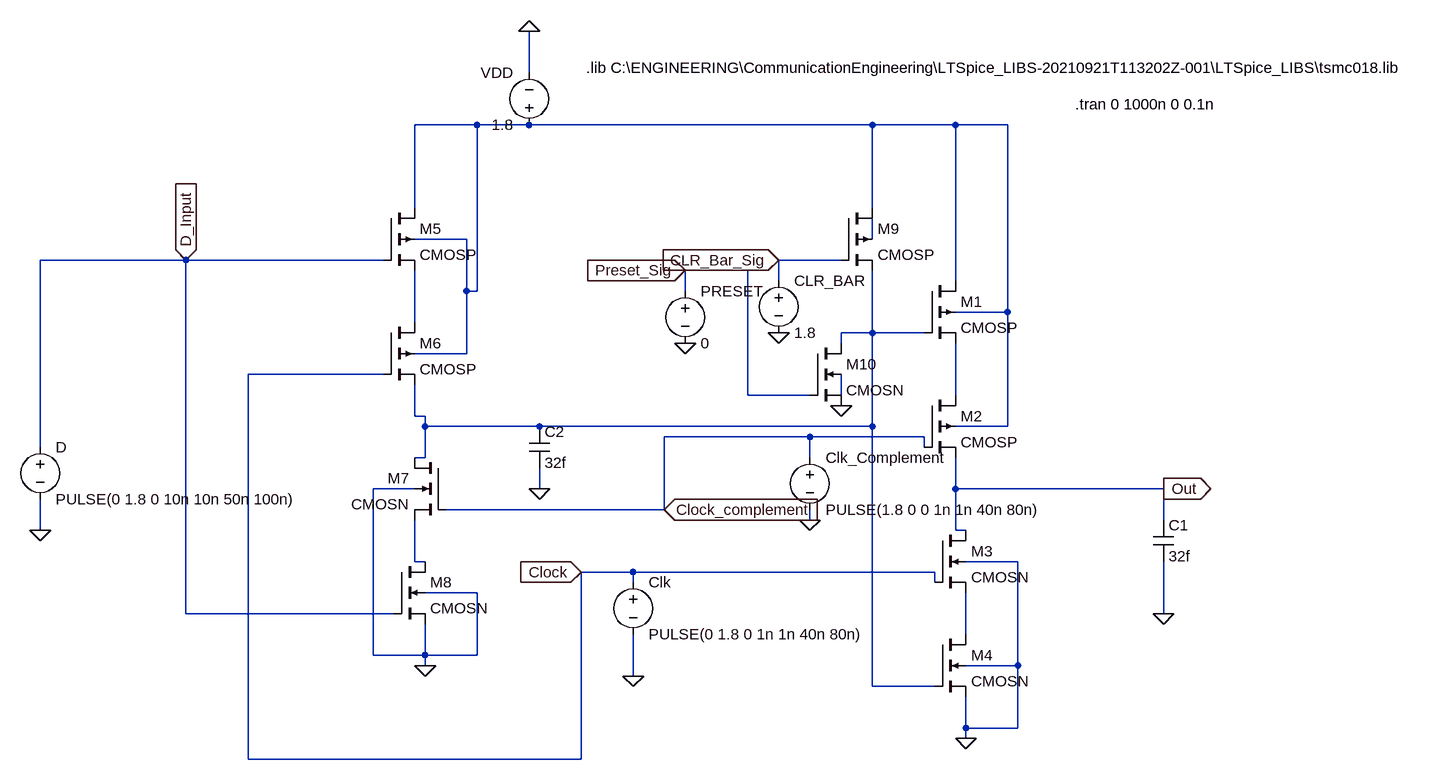
[diagram p0: schematic D_Flip_Flop_design.asc]
D_Flip_Flop_design.asc, the LTspice schematic file:
Version 4
SHEET 1 1324 1044
WIRE -160 -16 -160 -80
WIRE -240 64 -336 64
WIRE -160 64 -240 64
WIRE 368 64 -160 64
WIRE 496 64 368 64
WIRE 576 64 496 64
WIRE -336 192 -336 64
WIRE 368 192 368 64
WIRE -256 240 -336 240
WIRE 368 240 368 208
WIRE -688 272 -912 272
WIRE -384 272 -688 272
WIRE 320 272 224 272
WIRE 176 288 80 288
WIRE 224 304 224 272
WIRE 496 304 496 64
WIRE -256 320 -256 240
WIRE -240 320 -240 64
WIRE -240 320 -256 320
WIRE 80 320 80 288
WIRE 576 352 576 64
WIRE 576 352 496 352
WIRE -336 368 -336 288
WIRE 368 384 368 288
WIRE 368 384 320 384
WIRE 448 384 368 384
WIRE 320 400 320 384
WIRE -256 416 -256 320
WIRE -256 416 -336 416
WIRE -384 448 -592 448
WIRE 176 480 176 288
WIRE 272 480 176 480
WIRE 320 480 320 448
WIRE 496 480 496 400
WIRE -336 512 -336 464
WIRE -320 512 -336 512
WIRE -320 528 -320 512
WIRE -144 528 -320 528
WIRE 368 528 368 384
WIRE 368 528 -144 528
WIRE 576 528 576 352
WIRE 576 528 496 528
WIRE 272 544 48 544
WIRE 448 544 272 544
WIRE -912 560 -912 272
WIRE 448 560 448 544
WIRE -320 576 -320 528
WIRE -320 576 -336 576
WIRE 272 576 272 544
WIRE -336 624 -400 624
WIRE -144 624 -144 592
WIRE 496 624 496 576
WIRE 816 624 496 624
WIRE 48 656 48 544
WIRE 48 656 -288 656
WIRE 272 672 272 656
WIRE 816 672 816 624
WIRE -912 688 -912 640
WIRE 496 688 496 624
WIRE 512 688 496 688
WIRE -336 736 -336 672
WIRE -320 736 -336 736
WIRE 592 736 512 736
WIRE 0 752 -80 752
WIRE 464 752 0 752
WIRE 0 768 0 752
WIRE 464 768 464 752
WIRE -240 784 -320 784
WIRE -688 816 -688 272
WIRE -368 816 -688 816
WIRE 816 816 816 736
WIRE 512 848 512 784
WIRE -400 880 -400 624
WIRE -320 880 -320 832
WIRE -320 880 -400 880
WIRE -240 880 -240 784
WIRE -240 880 -320 880
WIRE -320 896 -320 880
WIRE 592 896 592 736
WIRE 592 896 512 896
WIRE 0 912 0 848
WIRE 368 928 368 528
WIRE 464 928 368 928
WIRE 512 992 512 944
WIRE 592 992 592 896
WIRE 592 992 512 992
WIRE 512 1008 512 992
WIRE -592 1040 -592 448
WIRE -80 1040 -80 752
WIRE -80 1040 -592 1040
FLAG -160 -80 0
FLAG 0 912 0
FLAG 512 1008 0
FLAG 816 816 0
FLAG 272 672 0
FLAG -320 896 0
FLAG -144 624 0
FLAG -912 688 0
FLAG 224 384 0
FLAG 320 496 0
FLAG 80 400 0
FLAG 80 288 Preset_Sig
IOPIN 80 288 In
FLAG 224 272 CLR_Bar_Sig
IOPIN 224 272 In
FLAG -80 752 Clock
IOPIN -80 752 In
FLAG -688 272 D_Input
IOPIN -688 272 In
FLAG 48 656 Clock_complement
IOPIN 48 656 In
FLAG 816 624 Out
IOPIN 816 624 Out
SYMBOL pmos4 448 304 R0
SYMATTR InstName M1
SYMATTR Value CMOSP
SYMATTR Value2 l=180n w=660n
SYMBOL pmos4 448 480 R0
SYMATTR InstName M2
SYMATTR Value CMOSP
SYMATTR Value2 l=180n w=660n
SYMBOL nmos4 464 688 R0
SYMATTR InstName M3
SYMATTR Value CMOSN
SYMATTR Value2 l=180n w=220n
SYMBOL nmos4 464 848 R0
SYMATTR InstName M4
SYMATTR Value CMOSN
SYMATTR Value2 l=180n w=220n
SYMBOL voltage -160 80 R180
WINDOW 0 24 96 Left 2
WINDOW 3 24 16 Left 2
SYMATTR InstName VDD
SYMATTR Value 1.8
SYMBOL voltage 0 752 R0
WINDOW 123 0 0 Left 0
WINDOW 39 0 0 Left 0
SYMATTR InstName Clk
SYMATTR Value PULSE(0 1.8 0 1n 1n 40n 80n)
SYMBOL cap 800 672 R0
SYMATTR InstName C1
SYMATTR Value 32f
SYMBOL voltage 272 560 R0
WINDOW 123 0 0 Left 0
WINDOW 39 0 0 Left 0
SYMATTR InstName Clk_Complement
SYMATTR Value PULSE(1.8 0 0 1n 1n 40n 80n)
SYMBOL pmos4 -384 192 R0
SYMATTR InstName M5
SYMATTR Value CMOSP
SYMATTR Value2 l=180n w=660n
SYMBOL pmos4 -384 368 R0
SYMATTR InstName M6
SYMATTR Value CMOSP
SYMATTR Value2 l=180n w=660n
SYMBOL nmos4 -288 576 M0
SYMATTR InstName M7
SYMATTR Value CMOSN
SYMATTR Value2 l=180n w=220n
SYMBOL nmos4 -368 736 R0
SYMATTR InstName M8
SYMATTR Value CMOSN
SYMATTR Value2 l=180n w=220n
SYMBOL cap -160 528 R0
SYMATTR InstName C2
SYMATTR Value 32f
SYMBOL voltage -912 544 R0
WINDOW 123 0 0 Left 0
WINDOW 39 0 0 Left 0
SYMATTR InstName D
SYMATTR Value PULSE(0 1.8 0 10n 10n 50n 100n)
SYMBOL pmos4 320 192 R0
SYMATTR InstName M9
SYMATTR Value CMOSP
SYMATTR Value2 l=180n w=660n
SYMBOL voltage 224 288 R0
WINDOW 123 0 0 Left 0
WINDOW 39 0 0 Left 0
SYMATTR InstName CLR_BAR
SYMATTR Value 1.8
SYMBOL nmos4 272 400 R0
SYMATTR InstName M10
SYMATTR Value CMOSN
SYMATTR Value2 l=180n w=220n
SYMBOL voltage 80 304 R0
WINDOW 123 0 0 Left 0
WINDOW 39 0 0 Left 0
SYMATTR InstName PRESET
SYMATTR Value 0
TEXT -72 -24 Left 2 !.lib C:\\ENGINEERING\\CommunicationEngineering\\LTSpice_LIBS-20210921T113202Z-001\\LTSpice_LIBS\\tsmc018.lib
TEXT 680 32 Left 2 !.tran 0 1000n 0 0.1n

The netlist it stands for:
* D_Flip_Flop_design.asc
M1 N001 N004 N006 N001 CMOSP l=180n w=660n
M2 N006 Clock_complement Out N001 CMOSP l=180n w=660n
M3 Out Clock N008 0 CMOSN l=180n w=220n
M4 N008 N004 0 0 CMOSN l=180n w=220n
VDD N001 0 1.8
V§Clk Clock 0 PULSE(0 1.8 0 1n 1n 40n 80n)
C1 Out 0 32f
V§Clk_Complement Clock_complement 0 PULSE(1.8 0 0 1n 1n 40n 80n)
M5 N001 D_Input N003 N001 CMOSP l=180n w=660n
M6 N003 Clock N004 N001 CMOSP l=180n w=660n
M7 N004 Clock_complement N007 0 CMOSN l=180n w=220n
M8 N007 D_Input 0 0 CMOSN l=180n w=220n
C2 N004 0 32f
V§D D_Input 0 PULSE(0 1.8 0 10n 10n 50n 100n)
M9 N001 CLR_Bar_Sig N004 N002 CMOSP l=180n w=660n
V§CLR_BAR CLR_Bar_Sig 0 1.8
M10 N004 Preset_Sig 0 N005 CMOSN l=180n w=220n
V§PRESET Preset_Sig 0 0
.model NMOS NMOS
.model PMOS PMOS
.lib standard.mos
.lib C:\ENGINEERING\CommunicationEngineering\LTSpice_LIBS-20210921T113202Z-001\LTSpice_LIBS\tsmc018.lib
.tran 0 1000n 0 0.1n
.backanno
.end